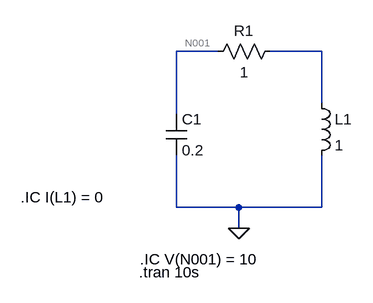
[diagram p0: schematic 3_80.asc]
3_80.asc, the LTspice schematic file:
Version 4
SHEET 1 880 680
WIRE 192 0 128 0
WIRE 352 0 272 0
WIRE 352 80 352 0
WIRE 128 96 128 0
WIRE 128 240 128 160
WIRE 224 240 128 240
WIRE 352 240 352 160
WIRE 352 240 224 240
WIRE 224 272 224 240
FLAG 224 272 0
SYMBOL cap 112 96 R0
SYMATTR InstName C1
SYMATTR Value 0.2
SYMBOL res 288 -16 R90
WINDOW 0 0 56 VBottom 0
WINDOW 3 32 56 VTop 0
SYMATTR InstName R1
SYMATTR Value 1
SYMBOL ind 336 64 R0
SYMATTR InstName L1
SYMATTR Value 1
TEXT 72 320 Left 0 !.IC V(N001) = 10
TEXT 70 340 Left 0 !.tran 10s
TEXT -112 224 Left 0 !.IC I(L1) = 0

The netlist it stands for:
* 3_80.asc
C1 N001 0 0.2
R1 N002 N001 1
L1 N002 0 1
.IC V(N001) = 10
.tran 10s
.IC I(L1) = 0
.backanno
.end